# Altium project VCU-BMS_Tester.PrjPCB (part 1 of 2)
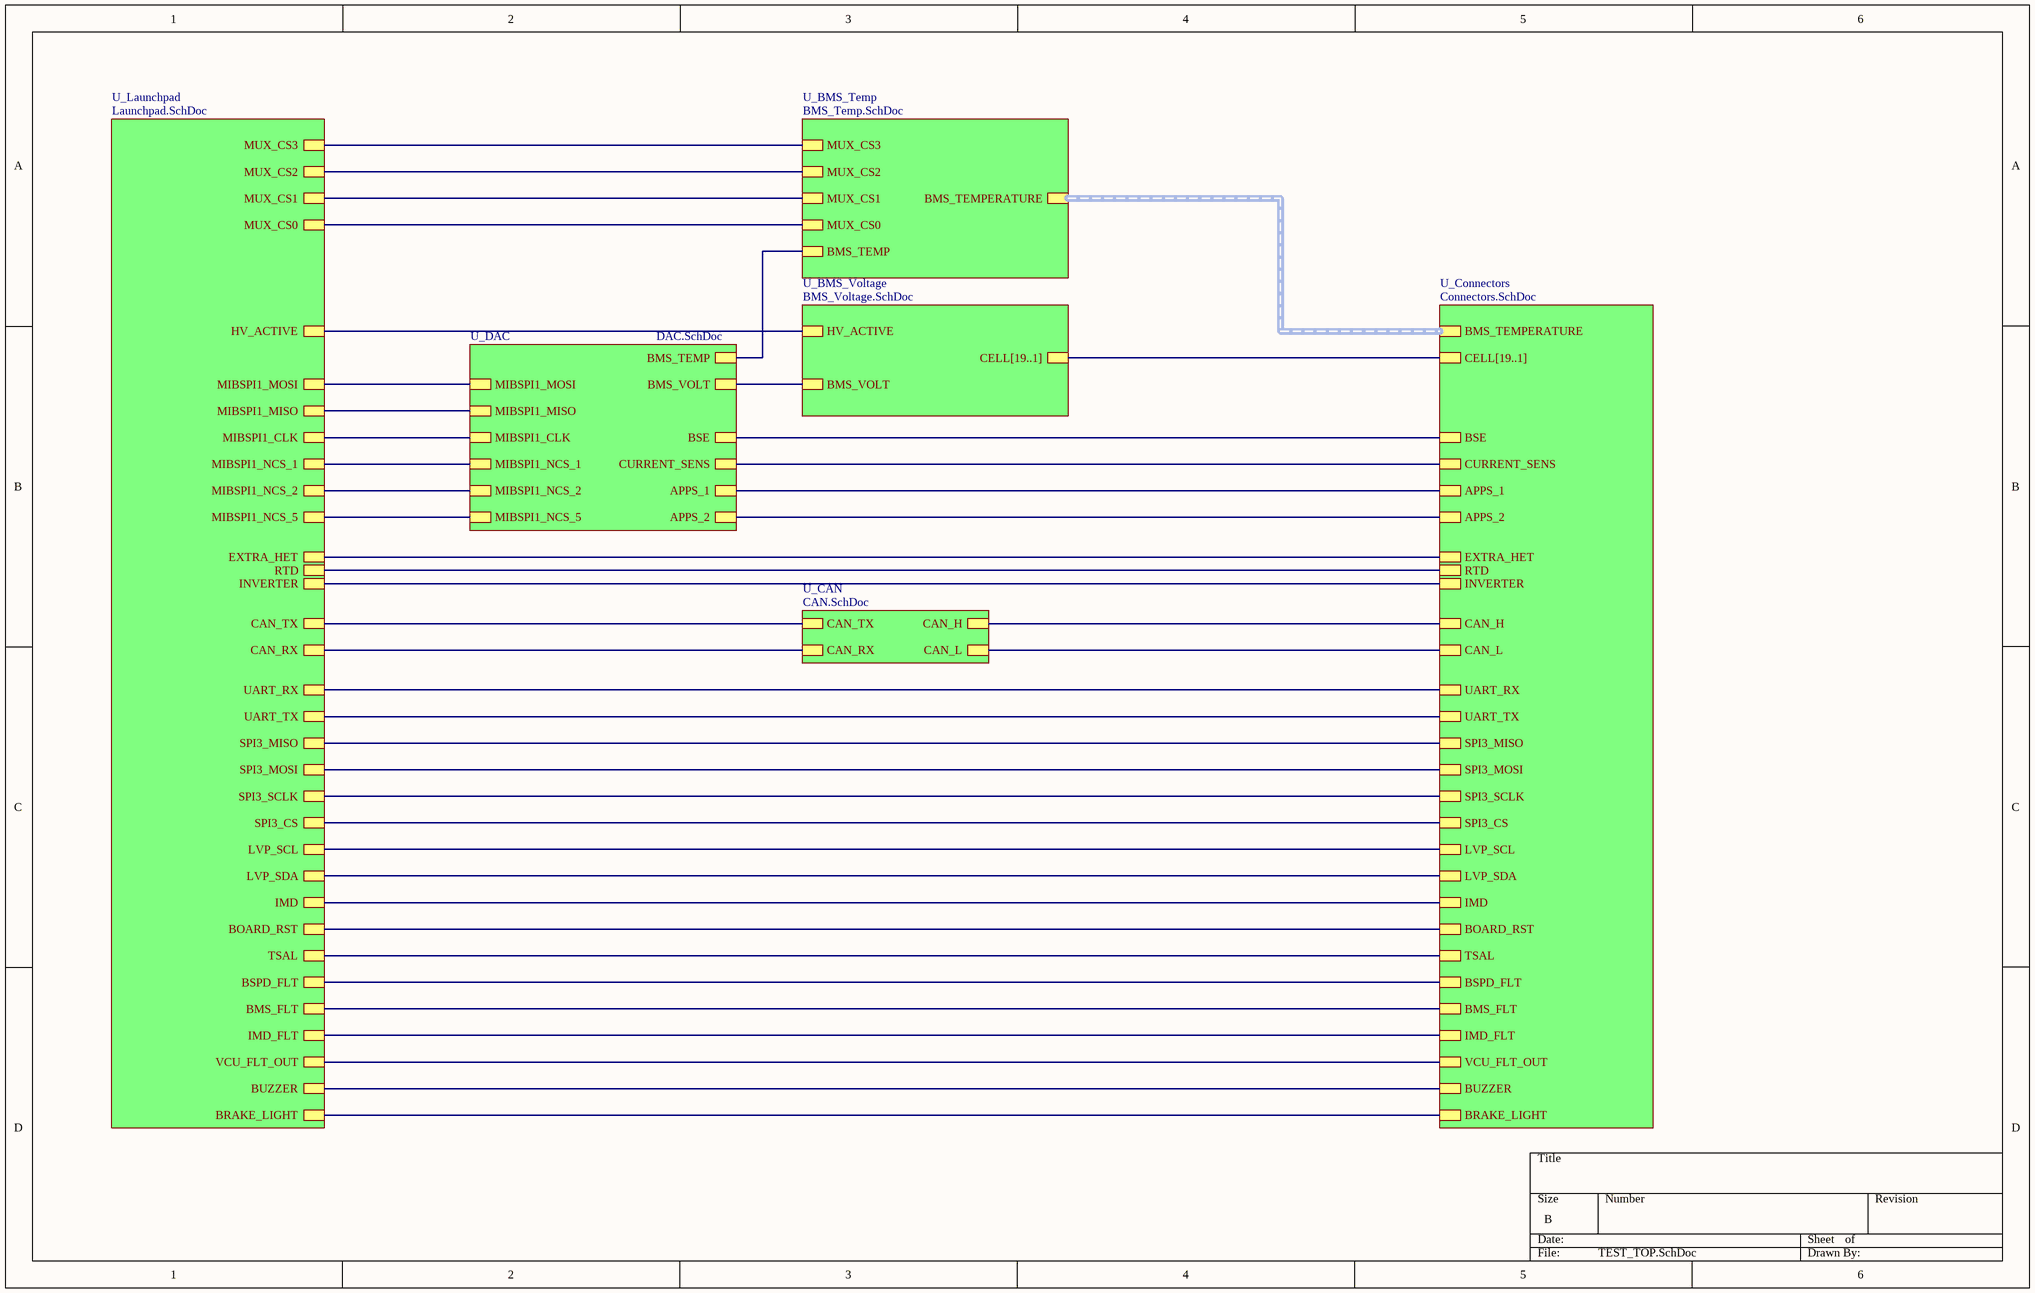
[diagram p0: TEST_TOP.SchDoc]
7 sheets, 117 parts. Net scope: hierarchical (ports join the sheet entries above them; power ports are global).
Board file: Tester_REV_0.PcbDoc
Sheets:
  TEST_TOP.SchDoc
    U_CAN = CAN.SchDoc
    U_Launchpad = Launchpad.SchDoc
    U_DAC = DAC.SchDoc
    U_Connectors = Connectors.SchDoc
    U_BMS_Temp = BMS_Temp.SchDoc
    U_BMS_Voltage = BMS_Voltage.SchDoc

## Sheet TEST_TOP.SchDoc
size B; Organization: Altium Limited; Address1: L3, 12a Rodborough Rd; Address2: Frenchs Forest; Address3: NSW; Address4: Australia 2086; SheetNumber: 1

### Sub-sheets
U_BMS_Temp = BMS_Temp.SchDoc: MUX_CS3, MUX_CS2, MUX_CS1, MUX_CS0, BMS_TEMP, BMS_TEMPERATURE (harness TEMP)
U_BMS_Voltage = BMS_Voltage.SchDoc: HV_ACTIVE, BMS_VOLT, CELL[19..1]
U_CAN = CAN.SchDoc: CAN_TX, CAN_RX, CAN_H, CAN_L
U_Connectors = Connectors.SchDoc: CAN_H, CAN_L, CURRENT_SENS, BSE, APPS_1, APPS_2, SPI3_CS, SPI3_SCLK, SPI3_MOSI, SPI3_MISO, LVP_SCL, LVP_SDA, BOARD_RST, IMD, TSAL, BSPD_FLT, BMS_FLT, IMD_FLT, VCU_FLT_OUT, BUZZER, BRAKE_LIGHT, BMS_TEMPERATURE (harness TEMP), UART_RX, UART_TX, CELL[19..1], EXTRA_HET, INVERTER, RTD
U_DAC = DAC.SchDoc: CURRENT_SENS, BSE, BMS_TEMP, BMS_VOLT, APPS_1, APPS_2, MIBSPI1_MOSI, MIBSPI1_MISO, MIBSPI1_CLK, MIBSPI1_NCS_1, MIBSPI1_NCS_2, MIBSPI1_NCS_5
U_Launchpad = Launchpad.SchDoc: MUX_CS2, MUX_CS3, MUX_CS1, MUX_CS0, SPI3_CS, SPI3_SCLK, SPI3_MOSI, SPI3_MISO, HV_ACTIVE, BOARD_RST, IMD, TSAL, CAN_TX, CAN_RX, LVP_SCL, LVP_SDA, MIBSPI1_MOSI, MIBSPI1_MISO, MIBSPI1_CLK, MIBSPI1_NCS_1, MIBSPI1_NCS_2, MIBSPI1_NCS_5, UART_RX, UART_TX, BSPD_FLT, BMS_FLT, IMD_FLT, VCU_FLT_OUT, BUZZER, BRAKE_LIGHT, EXTRA_HET, INVERTER, RTD

### Nets
APPS_1: sheet U_DAC/APPS_1, sheet U_Connectors/APPS_1
APPS_2: sheet U_DAC/APPS_2, sheet U_Connectors/APPS_2
BMS_FLT: sheet U_Launchpad/BMS_FLT, sheet U_Connectors/BMS_FLT
BMS_TEMP: sheet U_DAC/BMS_TEMP, sheet U_BMS_Temp/BMS_TEMP
BMS_VOLT: sheet U_DAC/BMS_VOLT, sheet U_BMS_Voltage/BMS_VOLT
BSE: sheet U_DAC/BSE, sheet U_Connectors/BSE
BSPD_FLT: sheet U_Launchpad/BSPD_FLT, sheet U_Connectors/BSPD_FLT
CAN_H: sheet U_CAN/CAN_H, sheet U_Connectors/CAN_H
CAN_L: sheet U_CAN/CAN_L, sheet U_Connectors/CAN_L
CAN_RX: sheet U_CAN/CAN_RX, sheet U_Launchpad/CAN_RX
CAN_TX: sheet U_CAN/CAN_TX, sheet U_Launchpad/CAN_TX
CURRENT_SENS: sheet U_DAC/CURRENT_SENS, sheet U_Connectors/CURRENT_SENS
EXTRA_HET: sheet U_Launchpad/EXTRA_HET, sheet U_Connectors/EXTRA_HET
HV_ACTIVE: sheet U_Launchpad/HV_ACTIVE, sheet U_BMS_Voltage/HV_ACTIVE
IMD: sheet U_Launchpad/IMD, sheet U_Connectors/IMD
IMD_FLT: sheet U_Launchpad/IMD_FLT, sheet U_Connectors/IMD_FLT
INVERTER: sheet U_Launchpad/INVERTER, sheet U_Connectors/INVERTER
MIBSPI1 CLK: sheet U_Launchpad/MIBSPI1_CLK, sheet U_DAC/MIBSPI1_CLK
MIBSPI1 MISO: sheet U_Launchpad/MIBSPI1_MISO, sheet U_DAC/MIBSPI1_MISO
MIBSPI1 MOSI: sheet U_Launchpad/MIBSPI1_MOSI, sheet U_DAC/MIBSPI1_MOSI
MIBSPI1 NCS_1: sheet U_Launchpad/MIBSPI1_NCS_1, sheet U_DAC/MIBSPI1_NCS_1
MIBSPI1 NCS_2: sheet U_Launchpad/MIBSPI1_NCS_2, sheet U_DAC/MIBSPI1_NCS_2
MIBSPI1 NCS_5: sheet U_Launchpad/MIBSPI1_NCS_5, sheet U_DAC/MIBSPI1_NCS_5
MUX_S0: sheet U_Launchpad/MUX_CS0, sheet U_BMS_Temp/MUX_CS0
MUX_S1: sheet U_Launchpad/MUX_CS1, sheet U_BMS_Temp/MUX_CS1
MUX_S2: sheet U_Launchpad/MUX_CS2, sheet U_BMS_Temp/MUX_CS2
MUX_S3: sheet U_Launchpad/MUX_CS3, sheet U_BMS_Temp/MUX_CS3
RTD: sheet U_Launchpad/RTD, sheet U_Connectors/RTD
SCL: sheet U_Launchpad/LVP_SCL, sheet U_Connectors/LVP_SCL
SDA: sheet U_Launchpad/LVP_SDA, sheet U_Connectors/LVP_SDA
SPI3_CLK: sheet U_Launchpad/SPI3_SCLK, sheet U_Connectors/SPI3_SCLK
SPI3_CS: sheet U_Launchpad/SPI3_CS, sheet U_Connectors/SPI3_CS
SPI3_MISO: sheet U_Launchpad/SPI3_MISO, sheet U_Connectors/SPI3_MISO
SPI3_MOSI: sheet U_Launchpad/SPI3_MOSI, sheet U_Connectors/SPI3_MOSI
TSAL: sheet U_Launchpad/TSAL, sheet U_Connectors/TSAL
UART_RX: sheet U_Launchpad/UART_RX, sheet U_Connectors/UART_RX
UART_TX: sheet U_Launchpad/UART_TX, sheet U_Connectors/UART_TX
VCU_FLT_OUT: sheet U_Launchpad/VCU_FLT_OUT, sheet U_Connectors/VCU_FLT_OUT
VCU_RST: sheet U_Launchpad/BOARD_RST, sheet U_Connectors/BOARD_RST
NetJ2_7: sheet U_Launchpad/BRAKE_LIGHT, sheet U_Connectors/BRAKE_LIGHT
NetJ2_9: sheet U_Launchpad/BUZZER, sheet U_Connectors/BUZZER

### Buses and harness runs
bus sheet U_BMS_Voltage/CELL[19..1] = sheet U_Connectors/CELL[19..1]
harness sheet U_BMS_Temp/BMS_TEMPERATURE = sheet U_Connectors/BMS_TEMPERATURE

### Notes on the sheet
- Title
- Size:
- Date:
- B
- Number:
- Time:
- Revision:
- Sheet
- of
- File:

## Sheet CAN.SchDoc
size A4; Organization: Altium Limited; Address1: L3, 12a Rodborough Rd; Address2: Frenchs Forest; Address3: NSW; Address4: Australia 2086; SheetNumber: 4
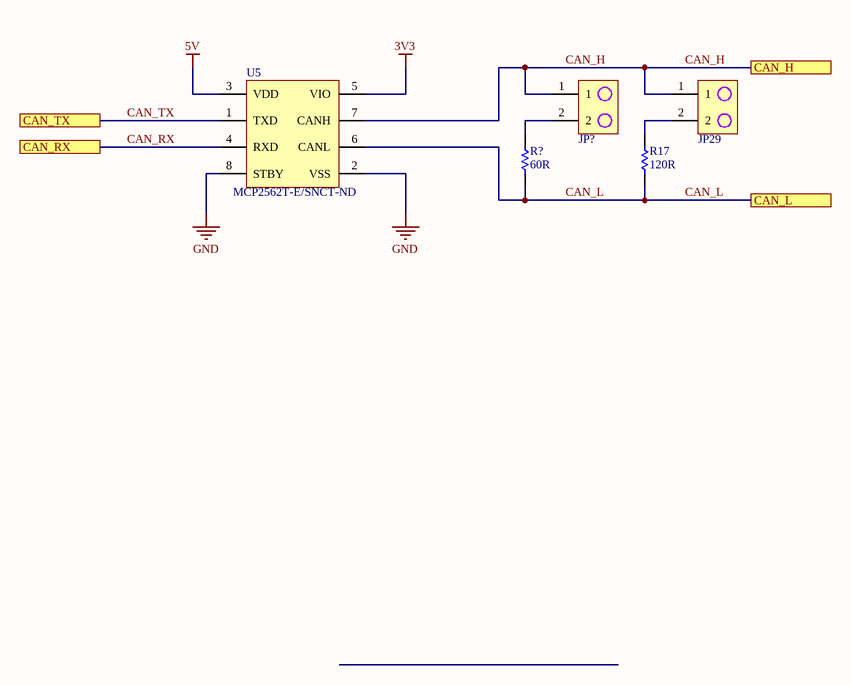
[diagram p1: CAN.SchDoc]

### Parts
(Parts that share a designator on the sheet are numbered #1, #2 ... from top to bottom, then left to right.)
JP29  732-5315-ND  [2PIN-JP]  (value not drawn)
JP?  732-5315-ND  [2PIN-JP]  (value not drawn)
R17  120R  [RES-0603]
R?#1  60R  [RES-0603]
U5  MCP2562T-E/SNCT-ND  [8-SOIC w/o THRM]

### Ports
CAN_H, CAN_L, CAN_RX, CAN_TX

### Nets
3V3: U5.5(VIO)
5V: U5.3(VDD)
GND: U5.2(VSS) U5.8(STBY)
CAN_H: JP29.1 JP?.1 U5.7(CANH) ; port CAN_H
CAN_L: R17.1 R?#1.1 U5.6(CANL) ; port CAN_L
CAN_RX: U5.4(RXD) ; port CAN_RX
CAN_TX: U5.1(TXD) ; port CAN_TX
NetJP29_2: JP29.2 R17.2
NetJP?_2: JP?.2 R?#1.2

### Notes on the sheet
- Title
- Size:
- Date:
- Tabloid
- Number:
- Time:
- Revision:
- Sheet
- of
- File:

### Library data of the parts
JP29 JP? = 2PIN-TEST: CONN HEADER VERT 2POS 2.54MM
R17 = 0603-120R: RES SMD 120 OHM 1% 1/10W 0603; Manufacturer: Yageo; Manufacturer Part Number: RC0603FR-07120RL; Voltage Rating (DC): 50V; Temperature Coefficient: 100ppm/°C; Power Rating: 100mW; Supplier 1: Digi-Key; Stock 1: 1047274; Pricing 1: 1=0.1, 10=0.023, 100=0.0094, 1000=0.00421, 2500=0.00366 (USD); Case/Package: 0603; Number of Pins: 2; Case Code (Metric): 1608; Case Code (Imperial): 0603; Min Operating Temperature: -55°C; Max Operating Temperature: 155°C; Resistance: 120R; Tolerance: 1%; Packaging: Tape and Reel; Composition: Thick Film; Voltage Rating: 50V; Package Quantity: 1; Number of Terminations: 2; Termination: SMD/SMT; Military Standard: Not; Max Power Dissipation: 100mW; Features: Moisture Resistant; Length: 1.6mm; Height: 0.022inch; Width: 0.031inch; Depth: 0.8mm; REACH SVHC: No SVHC; Lead Free: Lead Free; ComponentLink1URL: http://www.yageo.com/documents/recent/PYu-RC_Group_51_RoHS_L_10.pdf?src-supplier=Digi-Key; ComponentLink1Description: http://www.yageo.com/documents/recent/PYu-RC_Group_51_RoHS_L_10.pdf?src-supplier=Digi-Key; ComponentLink2URL: http://www.farnell.com/datasheets/2167052.pdf?src-supplier=Element14; ComponentLink2Description: http://www.farnell.com/datasheets/2167052.pdf?src-supplier=Element14; ComponentLink3URL: http://www.farnell.com/datasheets/1868787.pdf?src-supplier=Element14; ComponentLink3Description: http://www.farnell.com/datasheets/1868787.pdf?src-supplier=Element14; ComponentLink4URL: http://www.farnell.com/datasheets/443971.pdf?src-supplier=Element14; ComponentLink4Description: http://www.farnell.com/datasheets/443971.pdf?src-supplier=Element14; Supplier Part Number 1: 311-120HRDKR-ND
R?#1 = 0603-120R: RES SMD 120 OHM 1% 1/10W 0603; Manufacturer: Yageo; Manufacturer Part Number: RC0603FR-07120RL; Resistance: 120R; Voltage Rating (DC): 50V; Temperature Coefficient: 100ppm/°C; Power Rating: 100mW; Supplier 1: Digi-Key; Stock 1: 1047274; Pricing 1: 1=0.1, 10=0.023, 100=0.0094, 1000=0.00421, 2500=0.00366 (USD); Case/Package: 0603; Number of Pins: 2; Case Code (Metric): 1608; Case Code (Imperial): 0603; Min Operating Temperature: -55°C; Max Operating Temperature: 155°C; Tolerance: 1%; Packaging: Tape and Reel; Composition: Thick Film; Voltage Rating: 50V; Package Quantity: 1; Number of Terminations: 2; Termination: SMD/SMT; Military Standard: Not; Max Power Dissipation: 100mW; Features: Moisture Resistant; Length: 1.6mm; Height: 0.022inch; Width: 0.031inch; Depth: 0.8mm; REACH SVHC: No SVHC; Lead Free: Lead Free; ComponentLink1URL: http://www.yageo.com/documents/recent/PYu-RC_Group_51_RoHS_L_10.pdf?src-supplier=Digi-Key; ComponentLink1Description: http://www.yageo.com/documents/recent/PYu-RC_Group_51_RoHS_L_10.pdf?src-supplier=Digi-Key; ComponentLink2URL: http://www.farnell.com/datasheets/2167052.pdf?src-supplier=Element14; ComponentLink2Description: http://www.farnell.com/datasheets/2167052.pdf?src-supplier=Element14; ComponentLink3URL: http://www.farnell.com/datasheets/1868787.pdf?src-supplier=Element14; ComponentLink3Description: http://www.farnell.com/datasheets/1868787.pdf?src-supplier=Element14; ComponentLink4URL: http://www.farnell.com/datasheets/443971.pdf?src-supplier=Element14; ComponentLink4Description: http://www.farnell.com/datasheets/443971.pdf?src-supplier=Element14; Supplier Part Number 1: 311-120HRDKR-ND
U5 = CAN TRAN-MCP2562T-E/SN: IC TRANSCEIVER HALF 1/1 8SOIC; Manufacturer: Microchip; Propagation Delay: 125ns; Data Rate: 1Mbps; Nominal Supply Current: 85uA; Max Supply Voltage: 5.5V; Min Supply Voltage: 4.5V; Number of Transceivers: 1; Receiver Hysteresis: 200mV; Supplier 1: Digi-Key; Manufacturer Part Number: MCP2562T-E/SN; Stock 1: 0; Pricing 1: 1=0.9, 25=0.75, 100=0.68 (USD); Mount: Surface Mount; Case/Package: SOIC; Number of Pins: 8; Min Operating Temperature: -40°C; Max Operating Temperature: 125°C; Packaging: Tape and Reel; Package Quantity: 3300; Turn-On Delay Time: 125ns; Radiation Hardening: No; Lead Free: Lead Free; ComponentLink1URL: http://ww1.microchip.com/downloads/en/DeviceDoc/25167B.pdf?src-supplier=Digi-Key; ComponentLink1Description: http://ww1.microchip.com/downloads/en/DeviceDoc/25167B.pdf?src-supplier=Digi-Key; ComponentLink2URL: http://ww1.microchip.com/downloads/en/DeviceDoc/25167B.pdf?src-supplier=Avnet; ComponentLink2Description: http://ww1.microchip.com/downloads/en/DeviceDoc/25167B.pdf?src-supplier=Avnet; Supplier Part Number 1: MCP2562T-E/SNDKR-ND

## Sheet Launchpad.SchDoc
size A4; Organization: Altium Limited; Address1: L3, 12a Rodborough Rd; Address2: Frenchs Forest; Address3: NSW; Address4: Australia 2086; SheetNumber: 2
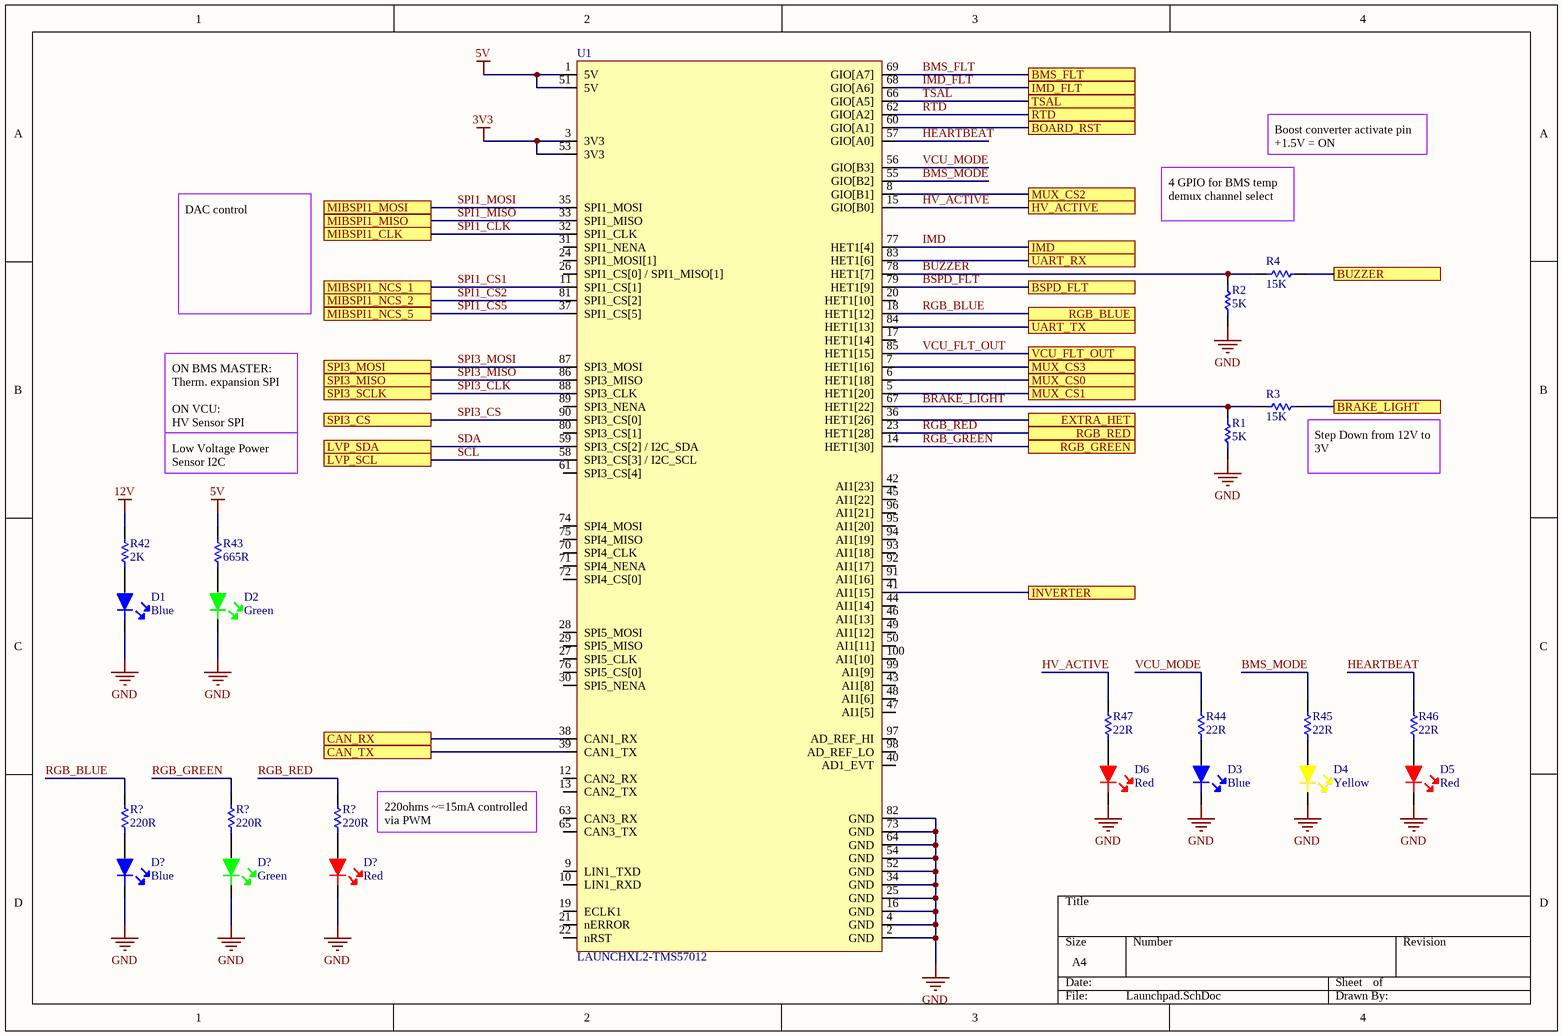
[diagram p2: Launchpad.SchDoc]

### Parts
(Parts that share a designator on the sheet are numbered #1, #2 ... from top to bottom, then left to right.)
D1  Blue  [LED-0603]
D2  Green  [LED-0603]
D3  Blue  [LED-0603]
D4  Yellow  [LED-0603]
D5  Red  [LED-0603]
D6  Red  [LED-0603]
D?#1  Blue  [LED-0603]
D?#2  Green  [LED-0603]
D?#3  Red  [LED-0603]
R1  5K  [RES-0603]
R2  5K  [RES-0603]
R3  15K  [RES-0603]
R4  15K  [RES-0603]
R42  2K  [RES-0603]
R43  665R  [RES-0603]
R44  22R  [RES-0603]
R45  22R  [RES-0603]
R46  22R  [RES-0603]
R47  22R  [RES-0603]
R?#2  220R  [RES-0603]
R?#3  220R  [RES-0603]
R?#4  220R  [RES-0603]
U1  LAUNCHXL2-TMS57012  [Hercules]

### Ports
BMS_FLT, BOARD_RST, BRAKE_LIGHT, BSPD_FLT, BUZZER, CAN_RX, CAN_TX, EXTRA_HET, HV_ACTIVE, IMD, IMD_FLT, INVERTER, LVP_SCL, LVP_SDA, MIBSPI1_CLK, MIBSPI1_MISO, MIBSPI1_MOSI, MIBSPI1_NCS_1, MIBSPI1_NCS_2, MIBSPI1_NCS_5, MUX_CS0, MUX_CS1, MUX_CS2, MUX_CS3, RGB_BLUE, RGB_GREEN, RGB_RED, RTD, SPI3_CS, SPI3_MISO, SPI3_MOSI, SPI3_SCLK, TSAL, UART_RX, UART_TX, VCU_FLT_OUT

### Nets
3V3: U1.3(3V3) U1.53(3V3)
5V: R43.2 U1.1(5V) U1.51(5V)
12V: R42.2
GND: D1.2 D2.2 D3.2 D4.2 D5.2 D6.2 D?#1.2 D?#2.2 D?#3.2 R1.1 R2.1 U1.2(GND) U1.4(GND) U1.16(GND) U1.25(GND) U1.34(GND) U1.52(GND) U1.54(GND) U1.64(GND) U1.73(GND) U1.82(GND)
BMS_FLT: U1.69(GIO[A7]) ; port BMS_FLT
BMS_MODE: R45.2 U1.55(GIO[B2])
BRAKE_LIGHT: R1.2 R3.1 U1.67(HET1[22])
BSPD_FLT: U1.79(HET1[9]) ; port BSPD_FLT
BUZZER: R2.2 R4.1 U1.78(HET1[7])
CAN_RX: U1.38(CAN1_RX) ; port CAN_RX
CAN_TX: U1.39(CAN1_TX) ; port CAN_TX
EXTRA_HET: U1.36(HET1[26]) ; port EXTRA_HET
HEARTBEAT: R46.2 U1.57(GIO[A0])
HV_ACTIVE: R47.2 U1.15(GIO[B0]) ; port HV_ACTIVE
IMD: U1.77(HET1[4]) ; port IMD
IMD_FLT: U1.68(GIO[A6]) ; port IMD_FLT
INVERTER: U1.41(AI1[15]) ; port INVERTER
MUX_S0: U1.6(HET1[18]) ; port MUX_CS0
MUX_S1: U1.5(HET1[20]) ; port MUX_CS1
MUX_S2: U1.8(GIO[B1]) ; port MUX_CS2
MUX_S3: U1.7(HET1[16]) ; port MUX_CS3
RGB_BLUE: R?#2.2 U1.18(HET1[12]) ; port RGB_BLUE
RGB_GREEN: R?#3.2 U1.14(HET1[30]) ; port RGB_GREEN
RGB_RED: R?#4.2 U1.23(HET1[28]) ; port RGB_RED
RTD: U1.62(GIO[A2]) ; port RTD
SCL: U1.58(SPI3_CS[3]_/_I2C_SCL) ; port LVP_SCL
SDA: U1.59(SPI3_CS[2]_/_I2C_SDA) ; port LVP_SDA
SPI1_CLK: U1.32(SPI1_CLK) ; port MIBSPI1_CLK  [project net MIBSPI1 CLK]
SPI1_CS1: U1.11(SPI1_CS[1]) ; port MIBSPI1_NCS_1  [project net MIBSPI1 NCS_1]
SPI1_CS2: U1.81(SPI1_CS[2]) ; port MIBSPI1_NCS_2  [project net MIBSPI1 NCS_2]
SPI1_CS5: U1.37(SPI1_CS[5]) ; port MIBSPI1_NCS_5  [project net MIBSPI1 NCS_5]
SPI1_MISO: U1.33(SPI1_MISO) ; port MIBSPI1_MISO  [project net MIBSPI1 MISO]
SPI1_MOSI: U1.35(SPI1_MOSI) ; port MIBSPI1_MOSI  [project net MIBSPI1 MOSI]
SPI3_CLK: U1.88(SPI3_CLK) ; port SPI3_SCLK
SPI3_CS: U1.90(SPI3_CS[0]) ; port SPI3_CS
SPI3_MISO: U1.86(SPI3_MISO) ; port SPI3_MISO
SPI3_MOSI: U1.87(SPI3_MOSI) ; port SPI3_MOSI
TSAL: U1.66(GIO[A5]) ; port TSAL
UART_RX: U1.83(HET1[6]) ; port UART_RX
UART_TX: U1.84(HET1[13]) ; port UART_TX
VCU_FLT_OUT: U1.85(HET1[15]) ; port VCU_FLT_OUT
VCU_MODE: R44.2 U1.56(GIO[B3])
VCU_RST: U1.60(GIO[A1]) ; port BOARD_RST
NetD1_1: D1.1 R42.1
NetD2_1: D2.1 R43.1
NetD3_1: D3.1 R44.1
NetD4_1: D4.1 R45.1
NetD5_1: D5.1 R46.1
NetD6_1: D6.1 R47.1
NetD?#1_1: D?#1.1 R?#2.1
NetD?#2_1: D?#2.1 R?#3.1
NetD?#3_1: D?#3.1 R?#4.1
NetJ2_7: R3.2 ; port BRAKE_LIGHT
NetJ2_9: R4.2 ; port BUZZER

Not connected (* = marked no-connect by the designer): U1 9(LIN1_TXD) 10(LIN1_RXD) 12(CAN2_RX) 13(CAN2_TX) 17(HET1[14]) 19(ECLK1) 20(HET1[10]) 21(nERROR) 22(nRST) 24(SPI1_MOSI[1]) 26(SPI1_CS[0]_/_SPI1_MISO[1]) 27(SPI5_CLK) 28(SPI5_MOSI) 29(SPI5_MISO) 30(SPI5_NENA) 31(SPI1_NENA) 40(AD1_EVT) 42(AI1[23]) 43(AI1[8]) 44(AI1[14]) 45(AI1[22]) 46(AI1[13]) 47(AI1[5]) 48(AI1[6]) 49(AI1[12]) 50(AI1[11]) 61(SPI3_CS[4]) 63(CAN3_RX) 65(CAN3_TX) 70(SPI4_CLK) 71(SPI4_NENA) 72(SPI4_CS[0]) 74(SPI4_MOSI) 75(SPI4_MISO) 76(SPI5_CS[0]) 80(SPI3_CS[1]) 89(SPI3_NENA) 91(AI1[16]) 92(AI1[17]) 93(AI1[18]) 94(AI1[19]) 95(AI1[20]) 96(AI1[21]) 97(AD_REF_HI) 98(AD_REF_LO) 99(AI1[9]) 100(AI1[10])

### Notes on the sheet
- Boost converter activate pin
  +1.5V = ON
- 4 GPIO for BMS temp demux channel select
- DAC control
- ON BMS MASTER:
  Therm. expansion SPI
  ON VCU:
  HV Sensor SPI
- Low Voltage Power Sensor I2C
- (near R3) Step Down from 12V to 3V
- 220ohms ~=15mA controlled via PWM
- Title
- Size:
- Date:
- B
- Number:
- Time:
- Revision:
- Sheet
- of
- File:

### Library data of the parts
D1 D3 D?#1 = LED-Blue: LED BLUE CLEAR 0603 SMD; Manufacturer: Wurth Electronics; Manufacturer Part Number: 150060BS75000; Luminous Intensity: 145mcd; Forward Current: 30mA; Forward Voltage: 3.2V; Wavelength: 470nm; Viewing Angle: 140°; Lens Style: Clear,Rectangular; Test Current: 20mA; Supplier 1: Digi-Key; Stock 1: 46078; Pricing 1: 1=0.16, 50=0.145, 100=0.125, 500=0.108 (USD); Mount: Surface Mount; Case/Package: 0603; Color: Blue; Case Code (Metric): 1608; Case Code (Imperial): 0603; Min Operating Temperature: -40°C; Max Operating Temperature: 85°C; Package Quantity: 4000; Packaging: Cut Tape; Dominant Wavelength: 470nm; Length: 1.6mm; Height: 0.7mm; Width: 0.8mm; REACH SVHC: Unknown; ComponentLink1URL: https://www.distrelec.biz/Web/Downloads/_t/ds/150060BS75000_eng_tds.pdf?mime=application%2Fpdf&src-supplier=Distrelec; ComponentLink1Description: https://www.distrelec.biz/Web/Downloads/_t/ds/150060BS75000_eng_tds.pdf?mime=application%2Fpdf&src-supplier=Distrelec; ComponentLink2URL: https://katalog.we-online.de/led/datasheet/150060BS75000.pdf?src-supplier=Digi-Key; ComponentLink2Description: https://katalog.we-online.de/led/datasheet/150060BS75000.pdf?src-supplier=Digi-Key; ComponentLink3URL: http://www.farnell.com/datasheets/1911343.pdf?src-supplier=Element14; ComponentLink3Description: http://www.farnell.com/datasheets/1911343.pdf?src-supplier=Element14; ComponentLink4URL: http://www.produktinfo.conrad.com/datenblaetter/750000-774999/759426-da-01-en-CHIPLED_0603_W_KL_BLAU_150060BS75000.pdf?src-supplier=Conrad; ComponentLink4Description: http://www.produktinfo.conrad.com/datenblaetter/750000-774999/759426-da-01-en-CHIPLED_0603_W_KL_BLAU_150060BS75000.pdf?src-supplier=Conrad; Supplier Part Number 1: 732-4966-6-ND
D2 D?#2 = LED-Green: LED GREEN CLEAR 0603 SMD; Manufacturer: Wurth Electronics; Manufacturer Part Number: 150060VS75000; Luminous Intensity: 40mcd; Viewing Angle: 140°; Forward Voltage: 2V; Wavelength: 570nm; Lens Style: Clear,Rectangular; Forward Current: 30mA; Test Current: 20mA; Supplier 1: Digi-Key; Stock 1: 118118; Pricing 1: 1=0.14, 50=0.133, 100=0.114, 500=0.099 (USD); Mount: Surface Mount; Case/Package: 0603; Number of Pins: 2; Color: Green; Case Code (Metric): 1608; Case Code (Imperial): 0603; Min Operating Temperature: -40°C; Max Operating Temperature: 85°C; Package Quantity: 1; Packaging: Tape and Reel; Dominant Wavelength: 570nm; Length: 1.6mm; Height: 0.7mm; Width: 0.8mm; REACH SVHC: Unknown; ComponentLink1URL: https://katalog.we-online.de/led/datasheet/150060VS75000.pdf?src-supplier=Digi-Key; ComponentLink1Description: https://katalog.we-online.de/led/datasheet/150060VS75000.pdf?src-supplier=Digi-Key; Supplier Part Number 1: 732-4980-1-ND
D4 = LED-Yellow: LED YELLOW CLEAR 0603 SMD; Manufacturer: Wurth Electronics; Manufacturer Part Number: 150060YS75000; Viewing Angle: 140°; Lens Style: Clear,Rectangular; Wavelength: 590nm; Luminous Intensity: 120mcd; Forward Voltage: 2V; Forward Current: 30mA; Test Current: 20mA; Supplier 1: Digi-Key; Stock 1: 78; Pricing 1: 1=0.14, 50=0.133, 100=0.114, 500=0.099 (USD); Mount: Surface Mount; Case/Package: 0603; Case Code (Metric): 1608; Case Code (Imperial): 0603; Color: Yellow; Min Operating Temperature: -40°C; Max Operating Temperature: 85°C; Package Quantity: 4000; Packaging: Tape and Reel; Dominant Wavelength: 590nm; Length: 1.6mm; Height: 0.7mm; Width: 0.8mm; REACH SVHC: Unknown; ComponentLink1URL: http://katalog.we-online.de/led/datasheet/150060YS75000.pdf?src-supplier=Newark; ComponentLink1Description: http://katalog.we-online.de/led/datasheet/150060YS75000.pdf?src-supplier=Newark; ComponentLink2URL: https://katalog.we-online.de/led/datasheet/150060YS75000.pdf?src-supplier=Digi-Key; ComponentLink2Description: https://katalog.we-online.de/led/datasheet/150060YS75000.pdf?src-supplier=Digi-Key; ComponentLink3URL: http://www.farnell.com/datasheets/1911348.pdf?src-supplier=Element14; ComponentLink3Description: http://www.farnell.com/datasheets/1911348.pdf?src-supplier=Element14; ComponentLink4URL: https://www.distrelec.biz/Web/Downloads/_t/ds/150060YS75000_eng_tds.pdf?mime=application%2Fpdf&src-supplier=Distrelec; ComponentLink4Description: https://www.distrelec.biz/Web/Downloads/_t/ds/150060YS75000_eng_tds.pdf?mime=application%2Fpdf&src-supplier=Distrelec; ComponentLink5URL: http://www.produktinfo.conrad.com/datenblaetter/750000-774999/759432-da-01-en-CHIPLED_0603_W_KL_GELB_150060YS75000.pdf?src-supplier=Conrad; ComponentLink5Description: http://www.produktinfo.conrad.com/datenblaetter/750000-774999/759432-da-01-en-CHIPLED_0603_W_KL_GELB_150060YS75000.pdf?src-supplier=Conrad; Supplier Part Number 1: 732-4981-6-ND
D5 D6 D?#3 = LED-Red: LED RED CLEAR 0603 SMD; Manufacturer: Wurth Electronics; Manufacturer Part Number: 150060RS75000; Viewing Angle: 140°; Lens Style: Clear,Rectangular; Luminous Intensity: 250mcd; Forward Current: 30mA; Forward Voltage: 2V; Wavelength: 625nm; Test Current: 20mA; Supplier 1: Digi-Key; Stock 1: 18518; Pricing 1: 1=0.14, 50=0.133, 100=0.114, 500=0.099 (USD); Mount: Surface Mount; Case/Package: 0603; Color: Red; Case Code (Metric): 1608; Case Code (Imperial): 0603; Min Operating Temperature: -40°C; Max Operating Temperature: 85°C; Package Quantity: 1; Packaging: Cut Tape; Dominant Wavelength: 625nm; Length: 1.6mm; Height: 0.7mm; Width: 0.8mm; REACH SVHC: Unknown; ComponentLink1URL: https://katalog.we-online.de/led/datasheet/150060RS75000.pdf?src-supplier=Digi-Key; ComponentLink1Description: https://katalog.we-online.de/led/datasheet/150060RS75000.pdf?src-supplier=Digi-Key; ComponentLink2URL: http://www.produktinfo.conrad.com/datenblaetter/750000-774999/759428-da-01-en-CHIPLED_0603_W_KL_ROT_150060RS75000.pdf?src-supplier=Conrad; ComponentLink2Description: http://www.produktinfo.conrad.com/datenblaetter/750000-774999/759428-da-01-en-CHIPLED_0603_W_KL_ROT_150060RS75000.pdf?src-supplier=Conrad; Supplier Part Number 1: 732-4978-6-ND
R1 R2 = 0603-5KR: RES SMD 4.99K OHM 1% 1/10W 0603; Manufacturer: Bourns; Manufacturer Part Number: CR0603-FX-4991ELF; Resistance: 4.99kR; Power Rating: 100mW; Voltage Rating: 50V; Temperature Coefficient: 100ppm/°C; Supplier 1: Digi-Key; Stock 1: 70557; Pricing 1: 1=0.1, 10=0.02, 25=0.0144, 50=0.011, 100=0.0082, 250=0.00624, 500=0.00498, 1000=0.00367 (USD); Mount: Surface Mount; Case/Package: 0603; Case Code (Imperial): 0603; Case Code (Metric): 1608; Contact Plating: Tin; Min Operating Temperature: -55°C; Max Operating Temperature: 155°C; Tolerance: 1%; Packaging: Tape and Reel; Package Quantity: 1; Composition: Thick Film; Termination: SMD/SMT; Number of Terminations: 2; Max Power Dissipation: 100mW; Features: Moisture Resistant; Length: 0.063inch; Height: 0.022inch; Width: 0.8mm; Thickness: 457um; Radiation Hardening: No; ComponentLink1URL: https://www.bourns.com/docs/Product-Datasheets/CHPREZTR.pdf?src-supplier=Digi-Key; ComponentLink1Description: https://www.bourns.com/docs/Product-Datasheets/CHPREZTR.pdf?src-supplier=Digi-Key; ComponentLink2URL: http://www.bourns.com/pdfs/chpreztr.pdf?src-supplier=Avnet; ComponentLink2Description: http://www.bourns.com/pdfs/chpreztr.pdf?src-supplier=Avnet; Supplier Part Number 1: CR0603-FX-4991ELFDKR-ND
R3 R4 = 0603-15KR: RES SMD 15K OHM 1% 1/10W 0603; Manufacturer: Yageo; Manufacturer Part Number: RC0603FR-0715KL; Resistance: 15kR; Temperature Coefficient: 100ppm/°C; Voltage Rating (DC): 50V; Power Rating: 100mW; Supplier 1: Digi-Key; Stock 1: 4670222; Pricing 1: 1=0.1, 10=0.023, 100=0.0094, 1000=0.00421, 2500=0.00366 (USD); Case/Package: 0603; Number of Pins: 2; Case Code (Metric): 1608; Case Code (Imperial): 0603; Min Operating Temperature: -55°C; Max Operating Temperature: 155°C; Tolerance: 1%; Packaging: Tape and Reel; Composition: Thick Film; Package Quantity: 1; Voltage Rating: 50V; Number of Terminations: 2; Termination: SMD/SMT; Military Standard: Not; Max Power Dissipation: 100mW; Features: Moisture Resistant; Length: 1.6mm; Height: 0.022inch; Width: 0.031inch; Depth: 0.8mm; REACH SVHC: Unknown; Lead Free: Lead Free; ComponentLink1URL: http://www.yageo.com/documents/recent/PYu-RC_Group_51_RoHS_L_10.pdf?src-supplier=Digi-Key; ComponentLink1Description: http://www.yageo.com/documents/recent/PYu-RC_Group_51_RoHS_L_10.pdf?src-supplier=Digi-Key; ComponentLink2URL: http://www.yageo.com/documents/recent/PYu-RC_Group_51_RoHS_L_9.pdf?src-supplier=Digi-Key; ComponentLink2Description: http://www.yageo.com/documents/recent/PYu-RC_Group_51_RoHS_L_9.pdf?src-supplier=Digi-Key; ComponentLink3URL: https://www.verical.com/server-webapp/html/getDatasheet?partID=327895&src-supplier=Verical; ComponentLink3Description: https://www.verical.com/server-webapp/html/getDatasheet?partID=327895&src-supplier=Verical; Supplier Part Number 1: 311-15.0KHRDKR-ND
R42 R?#2 = 0603-2KR: RES SMD 2K OHM 1% 1/4W 0603; Manufacturer: Vishay Dale; Manufacturer Part Number: CRCW06032K00FKEAHP; Resistance: 2kR; Power Rating: 250mW; Voltage Rating: 75V; Temperature Coefficient: 100ppm/°C; Supplier 1: Digi-Key; Stock 1: 23723; Pricing 1: 1=0.17, 10=0.142, 100=0.0553, 1000=0.02317, 2500=0.02124 (USD); Mount: Surface Mount; Case/Package: 0603; Weight: 7.1E-05oz; Case Code (Metric): 1608; Case Code (Imperial): 0603; Contact Plating: Tin; Min Operating Temperature: -55°C; Max Operating Temperature: 155°C; Package Quantity: 10; Tolerance: 1%; Packaging: Tape and Reel; Composition: Thick Film; Number of Terminations: 2; Termination: Solder; Max Power Dissipation: 250mW; Features: Automotive AEC-Q200; Military Standard: Not; Length: 1.6mm; Height: 0.45mm; Width: 0.033inch; Depth: 0.85mm; Radiation Hardening: No; Lead Free: Lead Free; ComponentLink1URL: http://www.vishay.com/docs/20043/crcwhpe3.pdf?src-supplier=Digi-Key; ComponentLink1Description: http://www.vishay.com/docs/20043/crcwhpe3.pdf?src-supplier=Digi-Key; Supplier Part Number 1: 541-2.00KSDKR-ND
R43 = 0603-665R: RES SMD 665 OHM 1% 1/10W 0603; Manufacturer: Yageo; Manufacturer Part Number: RC0603FR-07665RL; Power Rating: 100mW; Voltage Rating: 75V; Temperature Coefficient: 100ppm/°C; Voltage Rating (DC): 50V; Supplier 1: Digi-Key; Stock 1: 143871; Pricing 1: 1=0.1, 10=0.023, 100=0.0094, 1000=0.00421, 2500=0.00366 (USD); Case/Package: 0603; Weight: 7.1E-05oz; Case Code (Imperial): 0603; Case Code (Metric): 1608; Contact Plating: Tin,Matte; Min Operating Temperature: -55°C; Max Operating Temperature: 155°C; Resistance: 665R; Tolerance: 1%; Packaging: Tape and Reel; Termination: SMD/SMT; Composition: Thick Film; Military Standard: Not; Package Quantity: 1; Number of Terminations: 2; Max Power Dissipation: 100mW; Features: Moisture Resistant; Length: 1.6mm; Height: 0.022inch; Width: 0.8mm; Depth: 0.8mm; Lead Free: Lead Free; ComponentLink1URL: http://www.yageo.com/documents/recent/PYu-RC_Group_51_RoHS_L_9.pdf?src-supplier=Digi-Key; ComponentLink1Description: http://www.yageo.com/documents/recent/PYu-RC_Group_51_RoHS_L_9.pdf?src-supplier=Digi-Key; ComponentLink2URL: http://www.yageo.com/documents/recent/PYu-RC0603_51_RoHS_L_4.pdf?src-supplier=Avnet; ComponentLink2Description: http://www.yageo.com/documents/recent/PYu-RC0603_51_RoHS_L_4.pdf?src-supplier=Avnet; ComponentLink3URL: http://www.yageo.com/documents/recent/PYu-RC_Group_51_RoHS_L_10.pdf?src-supplier=Digi-Key; ComponentLink3Description: http://www.yageo.com/documents/recent/PYu-RC_Group_51_RoHS_L_10.pdf?src-supplier=Digi-Key; ComponentLink4URL: http://www.yageo.com/documents/recent/PYu-RC0603_51_RoHS_L_4.pdf?src-supplier=Avnet+Europe; ComponentLink4Description: http://www.yageo.com/documents/recent/PYu-RC0603_51_RoHS_L_4.pdf?src-supplier=Avnet+Europe; Supplier Part Number 1: 311-665HRDKR-ND
R44-R47 = 0603-22R: RES SMD 22 OHM 1% 1/10W; Manufacturer: Yageo; Manufacturer Part Number: RC0603FR-0722RL; Voltage Rating (DC): 50V; Temperature Coefficient: 100ppm/°C; Power Rating: 100mW; Supplier 1: Digi-Key; Stock 1: 2467850; Pricing 1: 1=0.1, 10=0.023, 100=0.0094, 1000=0.00421, 2500=0.00366 (USD); Case/Package: 0603; Number of Pins: 2; Case Code (Metric): 1608; Case Code (Imperial): 0603; Min Operating Temperature: -55°C; Max Operating Temperature: 155°C; Tolerance: 1%; Resistance: 22R; Packaging: Tape and Reel; Composition: Thick Film; Voltage Rating: 50V; Package Quantity: 1; Number of Terminations: 2; Termination: SMD/SMT; Military Standard: Not; Max Power Dissipation: 100mW; Features: Moisture Resistant; Length: 1.6mm; Height: 0.022inch; Width: 0.031inch; Depth: 0.8mm; REACH SVHC: No SVHC; Lead Free: Lead Free; ComponentLink1URL: http://www.yageo.com/documents/recent/PYu-RC_Group_51_RoHS_L_10.pdf?src-supplier=Digi-Key; ComponentLink1Description: http://www.yageo.com/documents/recent/PYu-RC_Group_51_RoHS_L_10.pdf?src-supplier=Digi-Key; ComponentLink2URL: http://documents.rs-components.com/techlib://itc_doclist_GB.htm?stockno=5050369&src-supplier=RSComponents; ComponentLink2Description: http://documents.rs-components.com/techlib://itc_doclist_GB.htm?stockno=5050369&src-supplier=RSComponents; ComponentLink3URL: http://www.farnell.com/datasheets/2167052.pdf?src-supplier=Element14; ComponentLink3Description: http://www.farnell.com/datasheets/2167052.pdf?src-supplier=Element14; ComponentLink4URL: http://www.farnell.com/datasheets/443971.pdf?src-supplier=Element14; ComponentLink4Description: http://www.farnell.com/datasheets/443971.pdf?src-supplier=Element14; Supplier Part Number 1: 311-22.0HRDKR-ND
R?#3 = 0603-665R: RES SMD 665 OHM 1% 1/10W 0603; Manufacturer: Yageo; Manufacturer Part Number: RC0603FR-07665RL; Resistance: 665R; Power Rating: 100mW; Voltage Rating: 75V; Temperature Coefficient: 100ppm/°C; Voltage Rating (DC): 50V; Supplier 1: Digi-Key; Stock 1: 143871; Pricing 1: 1=0.1, 10=0.023, 100=0.0094, 1000=0.00421, 2500=0.00366 (USD); Case/Package: 0603; Weight: 7.1E-05oz; Case Code (Imperial): 0603; Case Code (Metric): 1608; Contact Plating: Tin,Matte; Min Operating Temperature: -55°C; Max Operating Temperature: 155°C; Tolerance: 1%; Packaging: Tape and Reel; Termination: SMD/SMT; Composition: Thick Film; Military Standard: Not; Package Quantity: 1; Number of Terminations: 2; Max Power Dissipation: 100mW; Features: Moisture Resistant; Length: 1.6mm; Height: 0.022inch; Width: 0.8mm; Depth: 0.8mm; Lead Free: Lead Free; ComponentLink1URL: http://www.yageo.com/documents/recent/PYu-RC_Group_51_RoHS_L_9.pdf?src-supplier=Digi-Key; ComponentLink1Description: http://www.yageo.com/documents/recent/PYu-RC_Group_51_RoHS_L_9.pdf?src-supplier=Digi-Key; ComponentLink2URL: http://www.yageo.com/documents/recent/PYu-RC0603_51_RoHS_L_4.pdf?src-supplier=Avnet; ComponentLink2Description: http://www.yageo.com/documents/recent/PYu-RC0603_51_RoHS_L_4.pdf?src-supplier=Avnet; ComponentLink3URL: http://www.yageo.com/documents/recent/PYu-RC_Group_51_RoHS_L_10.pdf?src-supplier=Digi-Key; ComponentLink3Description: http://www.yageo.com/documents/recent/PYu-RC_Group_51_RoHS_L_10.pdf?src-supplier=Digi-Key; ComponentLink4URL: http://www.yageo.com/documents/recent/PYu-RC0603_51_RoHS_L_4.pdf?src-supplier=Avnet+Europe; ComponentLink4Description: http://www.yageo.com/documents/recent/PYu-RC0603_51_RoHS_L_4.pdf?src-supplier=Avnet+Europe; Supplier Part Number 1: 311-665HRDKR-ND
R?#4 = 0603-22R: RES SMD 22 OHM 1% 1/10W; Manufacturer: Yageo; Manufacturer Part Number: RC0603FR-0722RL; Voltage Rating (DC): 50V; Resistance: 22R; Temperature Coefficient: 100ppm/°C; Power Rating: 100mW; Supplier 1: Digi-Key; Stock 1: 2467850; Pricing 1: 1=0.1, 10=0.023, 100=0.0094, 1000=0.00421, 2500=0.00366 (USD); Case/Package: 0603; Number of Pins: 2; Case Code (Metric): 1608; Case Code (Imperial): 0603; Min Operating Temperature: -55°C; Max Operating Temperature: 155°C; Tolerance: 1%; Packaging: Tape and Reel; Composition: Thick Film; Voltage Rating: 50V; Package Quantity: 1; Number of Terminations: 2; Termination: SMD/SMT; Military Standard: Not; Max Power Dissipation: 100mW; Features: Moisture Resistant; Length: 1.6mm; Height: 0.022inch; Width: 0.031inch; Depth: 0.8mm; REACH SVHC: No SVHC; Lead Free: Lead Free; ComponentLink1URL: http://www.yageo.com/documents/recent/PYu-RC_Group_51_RoHS_L_10.pdf?src-supplier=Digi-Key; ComponentLink1Description: http://www.yageo.com/documents/recent/PYu-RC_Group_51_RoHS_L_10.pdf?src-supplier=Digi-Key; ComponentLink2URL: http://documents.rs-components.com/techlib://itc_doclist_GB.htm?stockno=5050369&src-supplier=RSComponents; ComponentLink2Description: http://documents.rs-components.com/techlib://itc_doclist_GB.htm?stockno=5050369&src-supplier=RSComponents; ComponentLink3URL: http://www.farnell.com/datasheets/2167052.pdf?src-supplier=Element14; ComponentLink3Description: http://www.farnell.com/datasheets/2167052.pdf?src-supplier=Element14; ComponentLink4URL: http://www.farnell.com/datasheets/443971.pdf?src-supplier=Element14; ComponentLink4Description: http://www.farnell.com/datasheets/443971.pdf?src-supplier=Element14; Supplier Part Number 1: 311-22.0HRDKR-ND
U1 = Hercules Launchpad: LAUNCHPAD TMS570LS12X EVAL BRD; Manufacturer: Texas Instruments; Evaluation Kit: Yes; Number of Bits: 32; Core Architecture: ARM; Supplier 1: Digi-Key; Manufacturer Part Number: LAUNCHXL2-TMS57012; Stock 1: 26; Pricing 1: 1=59.99 (USD); Packaging: Bulk; Package Quantity: 1; REACH SVHC: No SVHC; ComponentLink1URL: http://www.ti.com/tool/LAUNCHXL2-TMS57012?keyMatch=LAUNCHXL2-TMS57012&tisearch=Search-EN&src-supplier=Avnet+Asia; ComponentLink1Description: http://www.ti.com/tool/LAUNCHXL2-TMS57012?keyMatch=LAUNCHXL2-TMS57012&tisearch=Search-EN&src-supplier=Avnet+Asia; ComponentLink2URL: http://www.ti.com/lit/pdf/spnu611?src-supplier=Digi-Key; ComponentLink2Description: http://www.ti.com/lit/pdf/spnu611?src-supplier=Digi-Key; ComponentLink3URL: http://www.ti.com/lit/pdf/spnu611?src-supplier=Mouser; ComponentLink3Description: http://www.ti.com/lit/pdf/spnu611?src-supplier=Mouser; ComponentLink4URL: http://www.ti.com/tool/LAUNCHXL2-TMS57012?keyMatch=LAUNCHXL2-TMS57012&tisearch=Search-EN&src-supplier=Avnet; ComponentLink4Description: http://www.ti.com/tool/LAUNCHXL2-TMS57012?keyMatch=LAUNCHXL2-TMS57012&tisearch=Search-EN&src-supplier=Avnet; Supplier Part Number 1: 296-41109-ND

## Sheet DAC.SchDoc
size A4; Organization: Altium Limited; Address1: L3, 12a Rodborough Rd; Address2: Frenchs Forest; Address3: NSW; Address4: Australia 2086; SheetNumber: 3
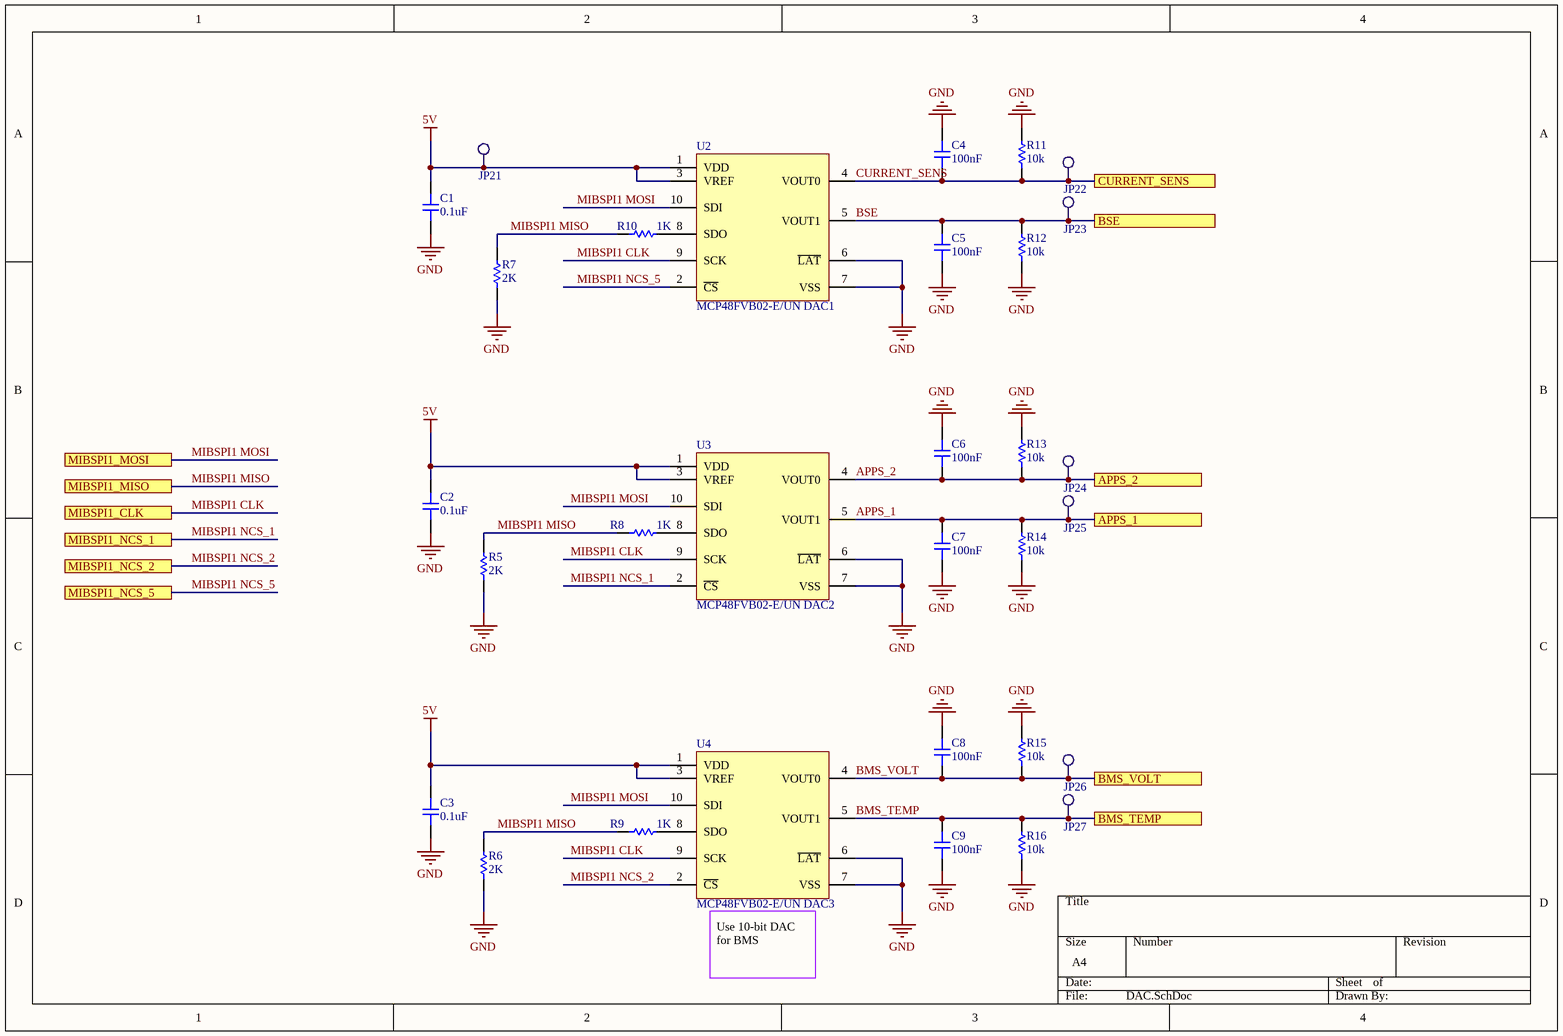
[diagram p3: DAC.SchDoc]

### Parts
C1  0.1uF  [CAP-0805]
C2  0.1uF  [CAP-0805]
C3  0.1uF  [CAP-0805]
C4  100nF  [CAP-0805]
C5  100nF  [CAP-0805]
C6  100nF  [CAP-0805]
C7  100nF  [CAP-0805]
C8  100nF  [CAP-0805]
C9  100nF  [CAP-0805]
JP21  Testpoint2  [TP2]  (value not drawn)
JP22  Testpoint2  [TP2]  (value not drawn)
JP23  Testpoint2  [TP2]  (value not drawn)
JP24  Testpoint2  [TP2]  (value not drawn)
JP25  Testpoint2  [TP2]  (value not drawn)
JP26  Testpoint2  [TP2]  (value not drawn)
JP27  Testpoint2  [TP2]  (value not drawn)
R5  2K  [RES-0805]
R6  2K  [RES-0805]
R7  2K  [RES-0805]
R8  1K  [RES-0805]
R9  1K  [RES-0805]
R10  1K  [RES-0805]
R11  10k  [RES-0805]
R12  10k  [RES-0805]
R13  10k  [RES-0805]
R14  10k  [RES-0805]
R15  10k  [RES-0805]
R16  10k  [RES-0805]
U2  MCP48FVB02-E/UN DAC1  [10MSOP]
U3  MCP48FVB02-E/UN DAC2  [10MSOP]
U4  MCP48FVB02-E/UN DAC3  [10MSOP]

### Ports
APPS_1, APPS_2, BMS_TEMP, BMS_VOLT, BSE, CURRENT_SENS, MIBSPI1_CLK, MIBSPI1_MISO, MIBSPI1_MOSI, MIBSPI1_NCS_1, MIBSPI1_NCS_2, MIBSPI1_NCS_5

### Nets
5V: C1.2 C2.2 C3.2 JP21.1 U2.1(VDD) U2.3(VREF) U3.1(VDD) U3.3(VREF) U4.1(VDD) U4.3(VREF)
GND: C1.1 C2.1 C3.1 C4.2 C5.1 C6.2 C7.1 C8.2 C9.1 R5.1 R6.1 R7.1 R11.2 R12.1 R13.2 R14.1 R15.2 R16.1 U2.6(~{LAT}) U2.7(VSS) U3.6(~{LAT}) U3.7(VSS) U4.6(~{LAT}) U4.7(VSS)
APPS_1: C7.2 JP25.1 R14.2 U3.5(VOUT1) ; port APPS_1
APPS_2: C6.1 JP24.1 R13.1 U3.4(VOUT0) ; port APPS_2
BMS_TEMP: C9.2 JP27.1 R16.2 U4.5(VOUT1) ; port BMS_TEMP
BMS_VOLT: C8.1 JP26.1 R15.1 U4.4(VOUT0) ; port BMS_VOLT
BSE: C5.2 JP23.1 R12.2 U2.5(VOUT1) ; port BSE
CURRENT_SENS: C4.1 JP22.1 R11.1 U2.4(VOUT0) ; port CURRENT_SENS
MIBSPI1 CLK: U2.9(SCK) U3.9(SCK) U4.9(SCK) ; port MIBSPI1_CLK
MIBSPI1 MISO: R5.2 R6.2 R7.2 R8.1 R9.1 R10.1 ; port MIBSPI1_MISO
MIBSPI1 MOSI: U2.10(SDI) U3.10(SDI) U4.10(SDI) ; port MIBSPI1_MOSI
MIBSPI1 NCS_1: U3.2(~{CS}) ; port MIBSPI1_NCS_1
MIBSPI1 NCS_2: U4.2(~{CS}) ; port MIBSPI1_NCS_2
MIBSPI1 NCS_5: U2.2(~{CS}) ; port MIBSPI1_NCS_5
NetR8_2: R8.2 U3.8(SDO)
NetR9_2: R9.2 U4.8(SDO)
NetR10_2: R10.2 U2.8(SDO)

### Notes on the sheet
- (near U4) Use 10-bit DAC for BMS
- Title
- Size:
- Date:
- Tabloid
- Number:
- Time:
- Revision:
- Sheet
- of
- File:

### Library data of the parts
C1-C3 = 0805-0.1uF-16V: CAP CER 0.1UF 16V Y5V 0805; Manufacturer: KEMET; Manufacturer Part Number: C0805C104Z4VACTU; Dielectric Material: Ceramic; Capacitance: 100nF; Tolerance: 80%; Supplier 1: Digi-Key; Stock 1: 18565; Pricing 1: 1=0.11, 10=0.081, 100=0.038, 500=0.02664, 1000=0.02205 (USD); Mount: Surface Mount; Case/Package: 0805; Case Code (Metric): 2012; Case Code (Imperial): 0805; Min Operating Temperature: -30°C; Max Operating Temperature: 85°C; Package Quantity: 1; Voltage Rating: 16V; Packaging: Tape and Reel; Voltage Rating (DC): 16V; Dielectric: Y5V; Termination: SMD/SMT; Length: 2mm; Height: 0.78mm; Width: 0.049inch; Thickness: 0.035inch; Lead Pitch: 0.75mm; Depth: 1.25mm; Lead Free: Lead Free; ComponentLink1URL: https://search.kemet.com/component-edge/download/datasheet/C0805C104Z4VACTU.pdf?src-supplier=Digi-Key; ComponentLink1Description: https://search.kemet.com/component-edge/download/datasheet/C0805C104Z4VACTU.pdf?src-supplier=Digi-Key; ComponentLink2URL: https://api.kemet.com/component-edge/download/datasheet/C0805C104Z4VACTU.pdf?src-supplier=Digi-Key; ComponentLink2Description: https://api.kemet.com/component-edge/download/datasheet/C0805C104Z4VACTU.pdf?src-supplier=Digi-Key; ComponentLink3URL: http://www.mouser.com/ds/2/212/KEM_C1005_Y5V_SMD-1101305.pdf?src-supplier=Mouser; ComponentLink3Description: http://www.mouser.com/ds/2/212/KEM_C1005_Y5V_SMD-1101305.pdf?src-supplier=Mouser; ComponentLink4URL: http://components.arrow.com/part/dataview/2091119S8993596N7429?src-supplier=Arrow; ComponentLink4Description: http://components.arrow.com/part/dataview/2091119S8993596N7429?src-supplier=Arrow; Supplier Part Number 1: 399-9159-6-ND
C4-C9 = 0805-0.1uF-16V: CAP CER 0.1UF 16V Y5V 0805; Manufacturer: KEMET; Manufacturer Part Number: C0805C104Z4VACTU; Dielectric Material: Ceramic; Tolerance: 80%; Supplier 1: Digi-Key; Stock 1: 18565; Pricing 1: 1=0.11, 10=0.081, 100=0.038, 500=0.02664, 1000=0.02205 (USD); Mount: Surface Mount; Case/Package: 0805; Case Code (Metric): 2012; Case Code (Imperial): 0805; Min Operating Temperature: -30°C; Max Operating Temperature: 85°C; Package Quantity: 1; Capacitance: 100nF; Voltage Rating: 16V; Packaging: Tape and Reel; Voltage Rating (DC): 16V; Dielectric: Y5V; Termination: SMD/SMT; Length: 2mm; Height: 0.78mm; Width: 0.049inch; Thickness: 0.035inch; Lead Pitch: 0.75mm; Depth: 1.25mm; Lead Free: Lead Free; ComponentLink1URL: https://search.kemet.com/component-edge/download/datasheet/C0805C104Z4VACTU.pdf?src-supplier=Digi-Key; ComponentLink1Description: https://search.kemet.com/component-edge/download/datasheet/C0805C104Z4VACTU.pdf?src-supplier=Digi-Key; ComponentLink2URL: https://api.kemet.com/component-edge/download/datasheet/C0805C104Z4VACTU.pdf?src-supplier=Digi-Key; ComponentLink2Description: https://api.kemet.com/component-edge/download/datasheet/C0805C104Z4VACTU.pdf?src-supplier=Digi-Key; ComponentLink3URL: http://www.mouser.com/ds/2/212/KEM_C1005_Y5V_SMD-1101305.pdf?src-supplier=Mouser; ComponentLink3Description: http://www.mouser.com/ds/2/212/KEM_C1005_Y5V_SMD-1101305.pdf?src-supplier=Mouser; ComponentLink4URL: http://components.arrow.com/part/dataview/2091119S8993596N7429?src-supplier=Arrow; ComponentLink4Description: http://components.arrow.com/part/dataview/2091119S8993596N7429?src-supplier=Arrow; Supplier Part Number 1: 399-9159-6-ND
JP21-JP27 = Testpoint2: Single layer pad TP
R5-R7 = 0805-2KR: RES SMD 2K OHM 1% 1/8W 0805; Manufacturer: Yageo Phycomp; Manufacturer Part Number: RC0805FR-0720KL; Power Rating: 125mW; Temperature Coefficient: 100ppm/°C; Voltage Rating (DC): 150V; Resistance: 20000R; ComponentLink1URL: http://www.yageo.com/documents/recent/PYu-RC_Group_51_RoHS_L_10.pdf?src-supplier=Digi-Key; ComponentLink1Description: http://www.yageo.com/documents/recent/PYu-RC_Group_51_RoHS_L_10.pdf?src-supplier=Digi-Key; ComponentLink2URL: http://www.yageo.com/documents/recent/PYu-RC_Group_51_RoHS_L_9.pdf?src-supplier=Digi-Key; ComponentLink2Description: http://www.yageo.com/documents/recent/PYu-RC_Group_51_RoHS_L_9.pdf?src-supplier=Digi-Key; ComponentLink3URL: http://documents.rs-components.com/techlib://itc_doclist_GB.htm?stockno=6182912&src-supplier=RSComponents; ComponentLink3Description: http://documents.rs-components.com/techlib://itc_doclist_GB.htm?stockno=6182912&src-supplier=RSComponents; ComponentLink4URL: http://www.farnell.com/datasheets/2167052.pdf?src-supplier=Element14; ComponentLink4Description: http://www.farnell.com/datasheets/2167052.pdf?src-supplier=Element14; ComponentLink5URL: http://www.mouser.com/ds/2/447/Yageo_08112016_RC0805-968729.pdf?src-supplier=Mouser; ComponentLink5Description: http://www.mouser.com/ds/2/447/Yageo_08112016_RC0805-968729.pdf?src-supplier=Mouser; Supplier 1: Digi-Key; Stock 1: 4531239; Pricing 1: 1=0.1, 10=0.04, 100=0.0163, 1000=0.00731, 2500=0.00635 (USD); Mount: Surface Mount; Case/Package: 0805; Number of Pins: 2; Min Operating Temperature: -55°C; Max Operating Temperature: 155°C; Tolerance: 1%; Packaging: Cut Tape; Length: 2mm; Height: 0.5mm; Depth: 1.25mm; Width: 1.25mm; Lead Free: Lead Free; Supplier Part Number 1: 311-20.0KCRDKR-ND
R8-R10 = 0805-1KR: RES SMD 1K OHM 1% 1/8W 0805; Manufacturer: Yageo; Manufacturer Part Number: RC0805FR-071KL; Resistance: 1kR; Temperature Coefficient: 100ppm/°C; Voltage Rating (DC): 150V; Power Rating: 125mW; Supplier 1: Digi-Key; Stock 1: 21491700; Pricing 1: 1=0.1, 10=0.04, 100=0.0163, 1000=0.00731, 2500=0.00635 (USD); Case/Package: 0805; Number of Pins: 2; Case Code (Metric): 2012; Case Code (Imperial): 0805; Min Operating Temperature: -55°C; Max Operating Temperature: 155°C; Tolerance: 1%; Packaging: Tape and Reel; Composition: Thick Film; Package Quantity: 1; Voltage Rating: 150V; Number of Terminations: 2; Termination: SMD/SMT; Military Standard: Not; Max Power Dissipation: 125mW; Features: Moisture Resistant; Length: 0.079inch; Height: 0.024inch; Width: 0.049inch; Depth: 1.25mm; REACH SVHC: Unknown; Lead Free: Lead Free; ComponentLink1URL: http://www.yageo.com/documents/recent/PYu-RC_Group_51_RoHS_L_10.pdf?src-supplier=Digi-Key; ComponentLink1Description: http://www.yageo.com/documents/recent/PYu-RC_Group_51_RoHS_L_10.pdf?src-supplier=Digi-Key; ComponentLink2URL: http://www.farnell.com/datasheets/1686128.pdf?src-supplier=Element14; ComponentLink2Description: http://www.farnell.com/datasheets/1686128.pdf?src-supplier=Element14; ComponentLink3URL: http://www.yageo.ru/pdf/RC0805.pdf?src-supplier=Future+Electronics; ComponentLink3Description: http://www.yageo.ru/pdf/RC0805.pdf?src-supplier=Future+Electronics; ComponentLink4URL: http://www.farnell.com/datasheets/2167052.pdf?src-supplier=Element14; ComponentLink4Description: http://www.farnell.com/datasheets/2167052.pdf?src-supplier=Element14; Supplier Part Number 1: 311-1.00KCRDKR-ND
R11-R16 = 0805-10KR: RES SMD 10K OHM 1% 1/8W 0805; Manufacturer: Yageo; Manufacturer Part Number: RC0805FR-0710KL; Resistance: 10kR; Temperature Coefficient: 100ppm/°C; Power Rating: 125mW; Voltage Rating: 150V; Supplier 1: Digi-Key; Stock 1: 26112993; Pricing 1: 1=0.1, 10=0.04, 100=0.0163, 1000=0.00731, 2500=0.00635 (USD); Case/Package: 0805; Case Code (Imperial): 0805; Case Code (Metric): 2012; Min Operating Temperature: -55°C; Max Operating Temperature: 155°C; Packaging: Tape and Reel; Tolerance: 1%; Composition: Thick Film; Package Quantity: 1; Termination: SMD/SMT; Number of Terminations: 2; Military Standard: Not; Max Power Dissipation: 125mW; Features: Moisture Resistant; Length: 2mm; Height: 0.024inch; Width: 0.049inch; Depth: 1.25mm; REACH SVHC: Unknown; Lead Free: Lead Free; ComponentLink1URL: http://www.yageo.com/documents/recent/PYu-RC_Group_51_RoHS_L_9.pdf?src-supplier=Mouser; ComponentLink1Description: http://www.yageo.com/documents/recent/PYu-RC_Group_51_RoHS_L_9.pdf?src-supplier=Mouser; ComponentLink2URL: http://www.farnell.com/datasheets/2167052.pdf?src-supplier=Element14; ComponentLink2Description: http://www.farnell.com/datasheets/2167052.pdf?src-supplier=Element14; ComponentLink3URL: http://www.yageo.com/documents/recent/PYu-RC_Group_51_RoHS_L_10.pdf?src-supplier=Digi-Key; ComponentLink3Description: http://www.yageo.com/documents/recent/PYu-RC_Group_51_RoHS_L_10.pdf?src-supplier=Digi-Key; ComponentLink4URL: http://www.yageo.ru/pdf/RC0805.pdf?src-supplier=Future+Electronics; ComponentLink4Description: http://www.yageo.ru/pdf/RC0805.pdf?src-supplier=Future+Electronics; Supplier Part Number 1: 311-10.0KCRCT-ND
U2-U4 = DAC-MCP48FVB02-E/UN: IC DAC 8BIT V-OUT 10MSOP; Manufacturer: Microchip; Number of Bits: 8; Number of D/A Converters: 2; Settling Time: 7.8us; Differential Output: No; Interface: SPI; Resolution: 8b; Supplier 1: Digi-Key; Manufacturer Part Number: MCP48FVB02-E/UN; Stock 1: 418; Pricing 1: 1=1.16, 25=0.97, 100=0.88 (USD); Case/Package: MSOP; Number of Pins: 10; Min Operating Temperature: -40°C; Max Operating Temperature: 125°C; Packaging: Rail/Tube; REACH SVHC: No SVHC; ComponentLink1URL: http://www.farnell.com/datasheets/2002391.pdf?src-supplier=Element14; ComponentLink1Description: http://www.farnell.com/datasheets/2002391.pdf?src-supplier=Element14; ComponentLink2URL: http://www.farnell.com/datasheets/2002391.pdf?src-supplier=Farnell; ComponentLink2Description: http://www.farnell.com/datasheets/2002391.pdf?src-supplier=Farnell; ComponentLink3URL: http://www.microchip.com/mymicrochip/filehandler.aspx?ddocname=en576860&src-supplier=Digi-Key; ComponentLink3Description: http://www.microchip.com/mymicrochip/filehandler.aspx?ddocname=en576860&src-supplier=Digi-Key; Supplier Part Number 1: MCP48FVB02-E/UN-ND